# Altium schematic sheet phase-shifters.SchDoc
size 420 x 297 mm; SheetNumber: 2; SheetTotal: 7
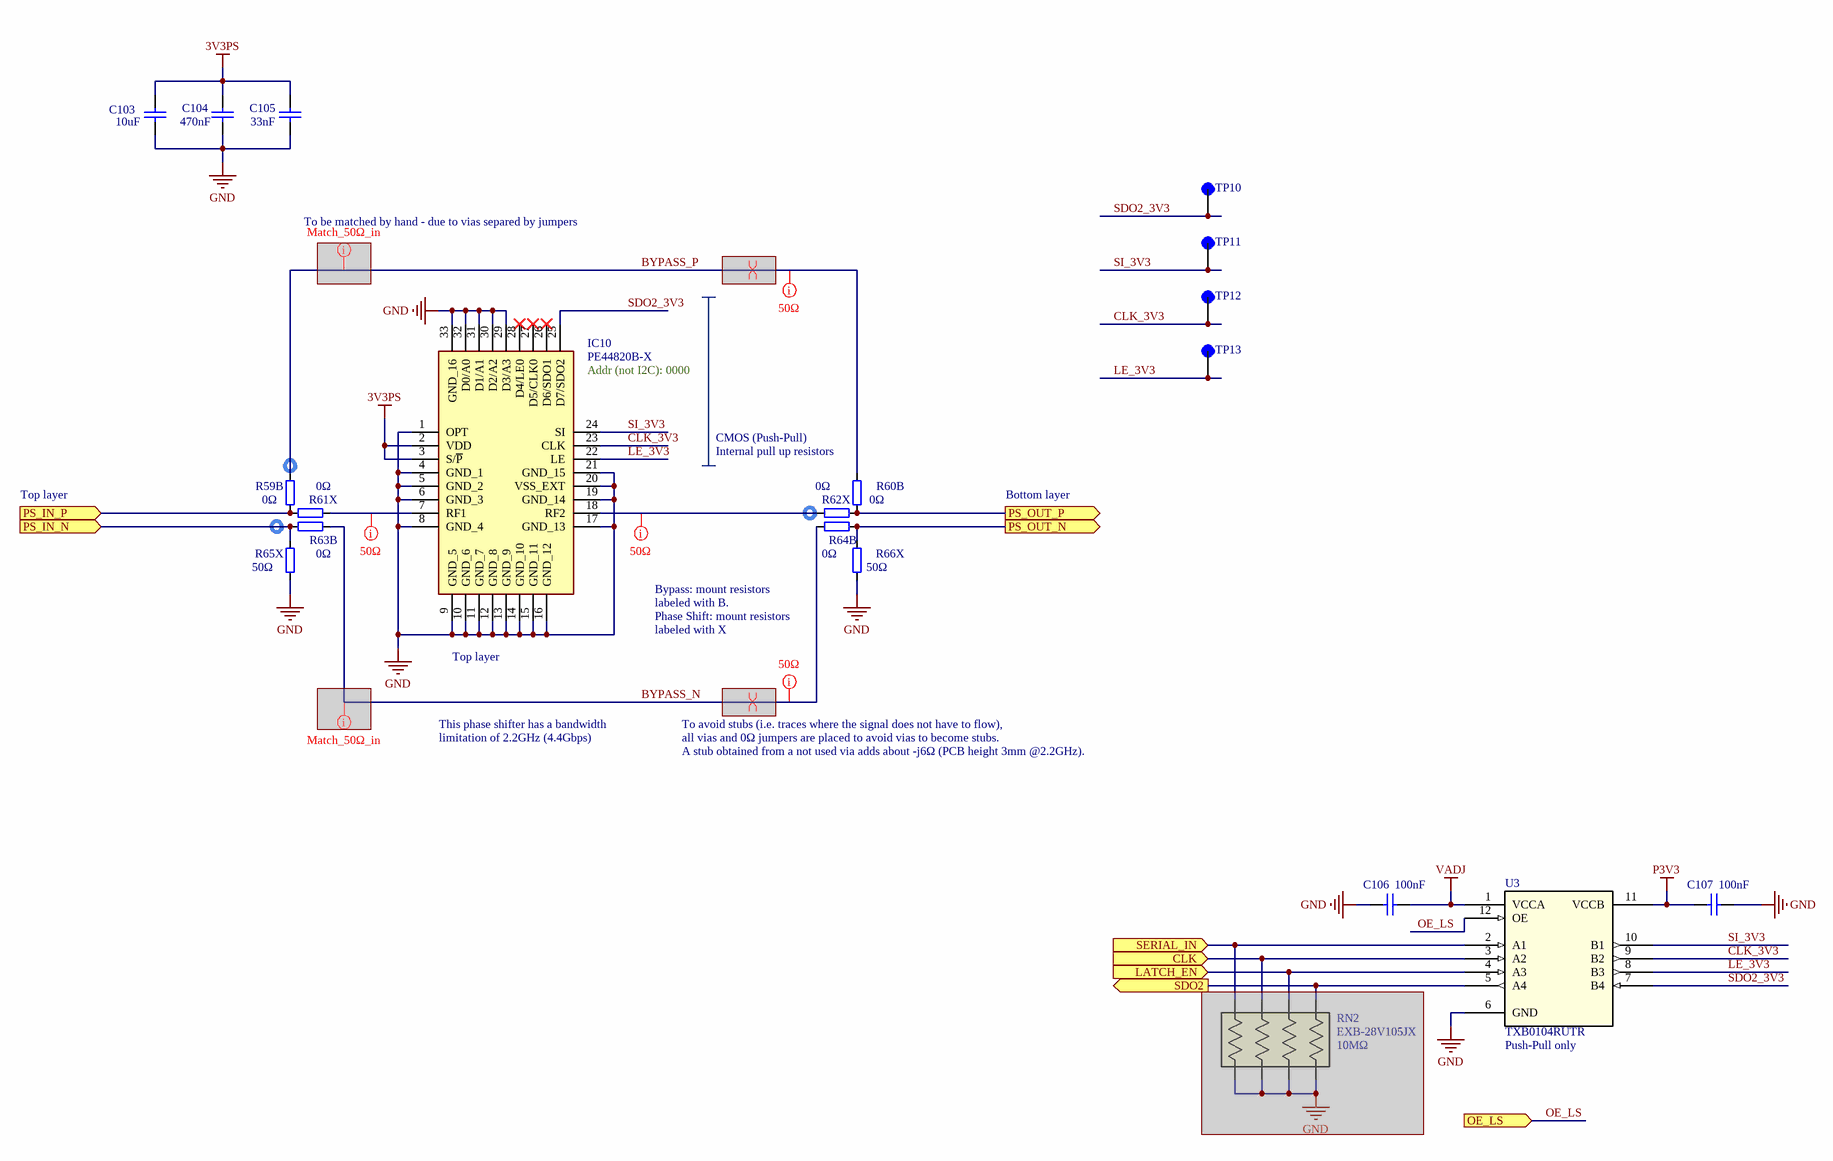
[diagram p0: phase-shifters.SchDoc]

## Parts
C103  10uF  [CAPC1608X87N]
C104  470nF  [CAPC0510X04N]
C105  33nF  [LLL03TR61E333KE01]
C106  100nF  [MURATA_HI_DENSITY_0201]
C107  100nF  [MURATA_HI_DENSITY_0201]
IC10  PE44820B-X  [QFN50P500X500X90-33N-D]
R59B  0Ω  [MURATA_HI_DENSITY_0201]
R60B  0Ω  [MURATA_HI_DENSITY_0201]
R61X  0Ω  [MURATA_HI_DENSITY_0201]
R62X  0Ω  [MURATA_HI_DENSITY_0201]
R63B  0Ω  [MURATA_HI_DENSITY_0201]
R64B  0Ω  [MURATA_HI_DENSITY_0201]
R65X  50Ω  [MURATA_HI_DENSITY_0201]
R66X  50Ω  [MURATA_HI_DENSITY_0201]
RN2  EXB-28V105JX  [EXB28V510JX]  (masked out: inside a compile mask, not in the netlist)
TP10  RCU-0C  [TP+195X110]  (value not drawn)
TP11  RCU-0C  [TP+195X110]  (value not drawn)
TP12  RCU-0C  [TP+195X110]  (value not drawn)
TP13  RCU-0C  [TP+195X110]  (value not drawn)
U3  TXB0104RUTR  [RUT12_TEX]

## Ports
CLK (in), LATCH_EN (in), OE_LS (in), PS_IN_N (in), PS_IN_P (in), PS_OUT_N (out), PS_OUT_P (out), SDO2 (out), SERIAL_IN (in)

## Nets
3V3PS: C103.2 C104.2 C105.2 IC10.2(VDD) IC10.3(S/~{P})
GND: C103.1 C104.1 C105.1 C106.1 C107.1 IC10.1(OPT) IC10.4(GND_1) IC10.5(GND_2) IC10.6(GND_3) IC10.8(GND_4) IC10.9(GND_5) IC10.10(GND_6) IC10.11(GND_7) IC10.12(GND_8) IC10.13(GND_9) IC10.14(GND_10) IC10.15(GND_11) IC10.16(GND_12) IC10.17(GND_13) IC10.19(GND_14) IC10.20(VSS_EXT) IC10.21(GND_15) IC10.29(D3/A3) IC10.30(D2/A2) IC10.31(D1/A1) IC10.32(D0/A0) IC10.33(GND_16) R65X.1 R66X.1 U3.6(GND)
P3V3: C107.2 U3.11(VCCB)
VADJ: C106.2 U3.1(VCCA)
BYPASS_N: R63B.1 R64B.2
BYPASS_P: R59B.2 R60B.2
CLK: U3.3(A2) ; port CLK
CLK_3V3: IC10.23(CLK) TP12.1(TP) U3.9(B2)
LATCH_EN: U3.4(A3) ; port LATCH_EN
LE_3V3: IC10.22(LE) TP13.1(TP) U3.8(B3)
OE_LS: U3.12(OE) ; port OE_LS
PS_IN_N: R63B.2 R65X.2 ; port PS_IN_N
PS_IN_P: R59B.1 R61X.2 ; port PS_IN_P
PS_OUT_N: R64B.1 R66X.2 ; port PS_OUT_N
PS_OUT_P: R60B.1 R62X.1 ; port PS_OUT_P
SDO2: U3.5(A4) ; port SDO2
SDO2_3V3: IC10.25(D7/SDO2) TP10.1(TP) U3.7(B4)
SERIAL_IN: U3.2(A1) ; port SERIAL_IN
SI_3V3: IC10.24(SI) TP11.1(TP) U3.10(B1)
NetIC10_7: IC10.7(RF1) R61X.1
NetIC10_18: IC10.18(RF2) R62X.2

Not connected (* = marked no-connect by the designer): IC10 26(D6/SDO1)* 27(D5/CLK0)* 28(D4/LE0)*

## Layout directives
differential pair: BYPASS_N, BYPASS_P
net class Match_50ohm_in: BYPASS_N, BYPASS_P
net class 50ohm: BYPASS_N, BYPASS_P, NetIC10_7, NetIC10_18

## Notes on the sheet
- To be matched by hand - due to vias separed by jumpers
- (near IC10) Addr (not I2C): 0000
- CMOS (Push-Pull)
- Top layer
- (near R60B) Internal pull up resistors
- Bottom layer
- Bypass: mount resistors labeled with B.
  Phase Shift: mount resistors labeled with X
- This phase shifter has a bandwidth limitation of 2.2GHz (4.4Gbps)
- To avoid stubs (i.e. traces where the signal does not have to flow),
  all vias and 0Ω jumpers are placed to avoid vias to become stubs.
  A stub obtained from a not used via adds about -j6Ω (PCB height 3mm @2.2GHz).
- (near RN2) 10MΩ
- (near U3) Push-Pull only
- Project/Equipment
- Document
- Designer
- Drawn by
- Check.by
- File
- Last Mod.
- Print Date
- Sheet
- Size
- A3
- of
- Rev

## Library data of the parts
C103 = CC0603_10UF_6.3V_20%_X5R: C1608X5R1E106M080AC; Part Description: SMD Multilayer Chip Ceramic Capacitor; Manufacturer: GENERIC; Manufacturer1 Part Number: C0603C106M9PAC; Voltage: 6.3V; TC: X5R; Tolerance: ±20%; Part Number: CC0603_10UF_6.3V_20%_X5R; Component Kind: Standard; Component Type: Standard; Pin Count: 2; Value: 10uF; Status: Preferred; Manufacturer Part Number: CC0603_10uF_6.3V_20%_X5R; Case: 0603; Mounted: Yes; Socket: No; SMD: Yes; Sense: No; Manufacturer1 Example: KEMET; Manufacturer1 ComponentHeight: 0.95mm; HelpURL: \\cern.ch\dfs\Applications\Altium\Datasheets\CC0603_X5R_KEMET.pdf; Author: CERN DEM JLC; CreateDate: 03/12/2007; LatestRevisionDate: 03/12/2007
C104 = Capacitor - non polarized: LLL153C70G474ME17; Value: 470nF
C105 = Capacitor - non polarized: LLL03TR61E333KE01; Value: 33nF
C106 C107 = C0201-100nF-high-density: GRM033R61C104KE14; Vmax: 16V; Value: 100nF
IC10 = PE44820B-X: Integrated Circuit; Manufacturer_Name: Peregrine Semiconductor; Datasheet Link: https://www.psemi.com/pdf/datasheets/pe44820ds.pdf; Height: 0.9mm; Manufacturer_Part_Number: PE44820B-X; Mouser Part Number: 81-PE44820B-X; Mouser Price/Stock: https://www.mouser.co.uk/ProductDetail/pSemi/PE44820B-X?qs=Cb2nCFKsA8prCrkfl5FDIQ%3D%3D
R59B R60B R61X R62X R63B R64B R65X R66X = R0201-100ohm-high-density: Resistor; Value: 100Ω
RN2 = EXB-28V105JX: Resistor Network; Manufacturer_Name: Panasonic; Datasheet Link: https://componentsearchengine.com/Datasheets/1/EXB-28V105JX.pdf; Height: 0mm; Manufacturer_Part_Number: EXB-28V105JX; Mouser Part Number: 667-EXB-28V105JX; Mouser Price/Stock: https://www.mouser.co.uk/ProductDetail/Panasonic/EXB-28V105JX?qs=cttFivMKqWzpuYBrjCbkjA%3D%3D; Arrow Part Number: EXB-28V105JX; Arrow Price/Stock: https://www.arrow.com/en/products/exb-28v105jx/panasonic
TP10-TP13 = RCU-0C: MF: {'manufacturer': u'TE Connectivity AMP Connectors'}; Package: None; Price: None; Value: *; MP: RCU-0C; Availability: Unavailable
U3 = TXB0104RUTR: No Description Available; Mfr_Name: Texas Instruments; RefDes: RefDes; Type: Type